# Altium schematic sheet RELAY18.SchDoc
size A
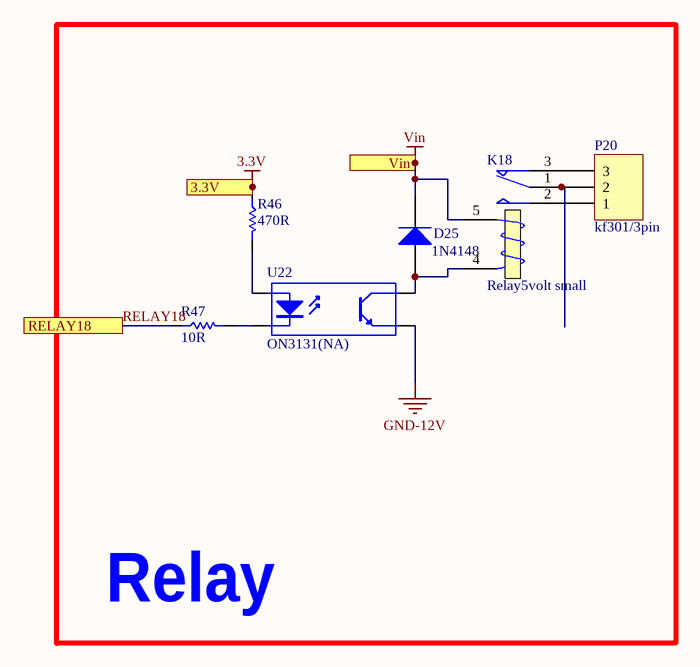
[diagram p0: RELAY18.SchDoc]

## Parts
D25  1N4148  [sod123]
K18  Relay5volt small  [relay5_childern]
P20  kf301/3pin  [Blue Connector 1*3 -kf301]
R46  470R  [0805/resistor]
R47  10R  [0805/resistor]
U22  ON3131(NA)  [OPTO_COUPLER]

## Blocks framed on the sheet
Relay: D25 K18 P20 R46 R47 U22

## Ports
3.3V, RELAY18, Vin

## Nets
3.3V: R46.1 ; port 3.3V
GND-12V: U22.3(E)
Vin: D25.K K18.5 ; port Vin
RELAY18: R47.1 ; port RELAY18
NetD25_A: D25.A K18.4(T2) U22.4(C)
NetK18_1: K18.1(COM) P20.2
NetK18_2: K18.2(NO) P20.1
NetK18_3: K18.3(T1) P20.3
NetR46_2: R46.2 U22.1(A)
NetR47_2: R47.2 U22.2(K)

## Library data of the parts
D25 = Diode 1N4007: 1 Amp General Purpose Rectifier; Published: 8-Jun-2000; LatestRevisionDate: 17-Jul-2002; LatestRevisionNote: Re-released for DXP Platform.; DatasheetVersion: 1998; PackageVersion: Aug-1999; PackageReference: DO-41; Publisher: Altium Limited; PackageDescription: Diode, Axial; Body 5.2 x 2.7 mm (LxDia. max), Lead Dia. 0.86 mm (max); Code_JEDEC: DO-204-AL; ComponentLink1Description: Manufacturer Link; ComponentLink1URL: http://www.fairchildsemi.com/; ComponentLink2Description: Datasheet; ComponentLink2URL: http://www.fairchildsemi.com/ds/1N%2F1N4001.pdf
K18 = Relay: SPDT Relay; Published: 8-Jun-2000; LatestRevisionDate: 17-Jul-2002; LatestRevisionNote: Re-released for DXP Platform.; PackageReference: MODULE5B; Publisher: Altium Limited
P20 = Header 3: LatestRevisionDate: 17-Jul-2002; LatestRevisionNote: Re-released for DXP Platform.; Publisher: Altium Limited
R46 R47 = Resistor: Tolerance: 5%; Power: 1/8 W
  R46: Value: 470R
  R47: Value: 10R
U22 = Optoisolator1: 4-Pin Phototransistor Optocoupler; Published: 24-Mar-1999; LatestRevisionDate: 04-Mar-2005; LatestRevisionNote: Sch pins 3 & 4 Swapped.; DatasheetVersion: Nov-2003; PackageReference: DIP-4; Publisher: Altium Limited